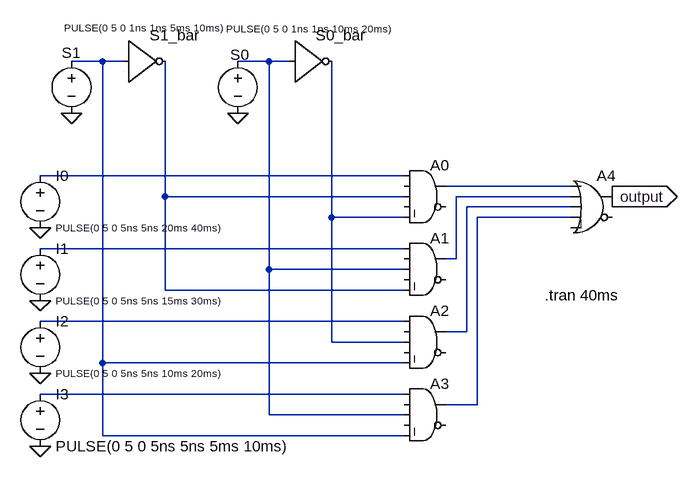
[diagram p0: schematic 4to1MUX.asc]
4to1MUX.asc, the LTspice schematic file:
Version 4.1
SHEET 1 1096 980
WIRE 176 64 128 64
WIRE 208 64 176 64
WIRE 432 64 384 64
WIRE 464 64 432 64
WIRE 640 240 80 240
WIRE 896 256 704 256
WIRE 272 272 272 64
WIRE 640 272 272 272
WIRE 896 272 720 272
WIRE 896 288 736 288
WIRE 528 304 528 64
WIRE 640 304 528 304
WIRE 896 304 752 304
WIRE 640 352 80 352
WIRE 720 368 720 272
WIRE 720 368 704 368
WIRE 432 384 432 64
WIRE 640 384 432 384
WIRE 272 416 272 272
WIRE 640 416 272 416
WIRE 640 464 80 464
WIRE 736 480 736 288
WIRE 736 480 704 480
WIRE 528 496 528 304
WIRE 640 496 528 496
WIRE 176 528 176 64
WIRE 640 528 176 528
WIRE 640 576 80 576
WIRE 752 592 752 304
WIRE 752 592 704 592
WIRE 432 608 432 384
WIRE 640 608 432 608
WIRE 176 640 176 528
WIRE 640 640 176 640
FLAG 80 320 0
FLAG 384 144 0
FLAG 80 432 0
FLAG 80 544 0
FLAG 80 656 0
FLAG 128 144 0
FLAG 960 272 output
IOPIN 960 272 Out
SYMBOL voltage 128 48 R0
WINDOW 0 -15 3 Left 2
WINDOW 3 108 -36 Center 1
WINDOW 123 0 0 Left 0
WINDOW 39 0 0 Left 0
SYMATTR InstName S1
SYMATTR Value PULSE(0 5 0 1ns 1ns 5ms 10ms)
SYMBOL voltage 384 48 R0
WINDOW 0 -12 6 Left 2
WINDOW 3 -18 -34 Left 1
WINDOW 123 0 0 Left 0
WINDOW 39 0 0 Left 0
SYMATTR InstName S0
SYMATTR Value PULSE(0 5 0 1ns 1ns 10ms 20ms)
SYMBOL Digital\\inv 208 0 R0
SYMATTR InstName S1_bar
SYMBOL Digital\\inv 464 0 R0
SYMATTR InstName S0_bar
SYMBOL Digital\\and 672 208 R0
SYMATTR InstName A0
SYMBOL Digital\\and 672 320 R0
SYMATTR InstName A1
SYMBOL Digital\\and 672 432 R0
SYMATTR InstName A2
SYMBOL Digital\\and 672 544 R0
SYMATTR InstName A3
SYMBOL voltage 80 224 R0
WINDOW 3 24 96 Left 1
WINDOW 123 0 0 Left 0
WINDOW 39 0 0 Left 0
SYMATTR Value PULSE(0 5 0 5ns 5ns 20ms 40ms)
SYMATTR InstName I0
SYMBOL voltage 80 336 R0
WINDOW 3 24 96 Left 1
WINDOW 123 0 0 Left 0
WINDOW 39 0 0 Left 0
SYMATTR Value PULSE(0 5 0 5ns 5ns 15ms 30ms)
SYMATTR InstName I1
SYMBOL voltage 80 448 R0
WINDOW 3 24 96 Left 1
WINDOW 123 0 0 Left 0
WINDOW 39 0 0 Left 0
SYMATTR Value PULSE(0 5 0 5ns 5ns 10ms 20ms)
SYMATTR InstName I2
SYMBOL voltage 80 560 R0
WINDOW 123 0 0 Left 0
WINDOW 39 0 0 Left 0
SYMATTR InstName I3
SYMATTR Value PULSE(0 5 0 5ns 5ns 5ms 10ms)
SYMBOL Digital\\or 928 224 R0
SYMATTR InstName A4
TEXT 856 424 Left 2 !.tran 40ms

The netlist it stands for:
* 4to1MUX.asc
V§S1 N001 0 PULSE(0 5 0 1ns 1ns 5ms 10ms)
V§S0 N002 0 PULSE(0 5 0 1ns 1ns 10ms 20ms)
A§S1_bar N001 0 0 0 0 N005 0 0 BUF
A§S0_bar N002 0 0 0 0 N008 0 0 BUF
A0 N003 0 N005 0 N008 0 N004 0 AND
A1 N010 0 N002 0 N005 0 N006 0 AND
A2 N011 0 N008 0 N001 0 N007 0 AND
A3 N012 0 N002 0 N001 0 N009 0 AND
V§I0 N003 0 PULSE(0 5 0 5ns 5ns 20ms 40ms)
V§I1 N010 0 PULSE(0 5 0 5ns 5ns 15ms 30ms)
V§I2 N011 0 PULSE(0 5 0 5ns 5ns 10ms 20ms)
V§I3 N012 0 PULSE(0 5 0 5ns 5ns 5ms 10ms)
A4 N004 N006 N007 N009 0 0 output 0 OR
.tran 40ms
.backanno
.end